# EAGLE design theremin-shield (EAGLE 6.0)
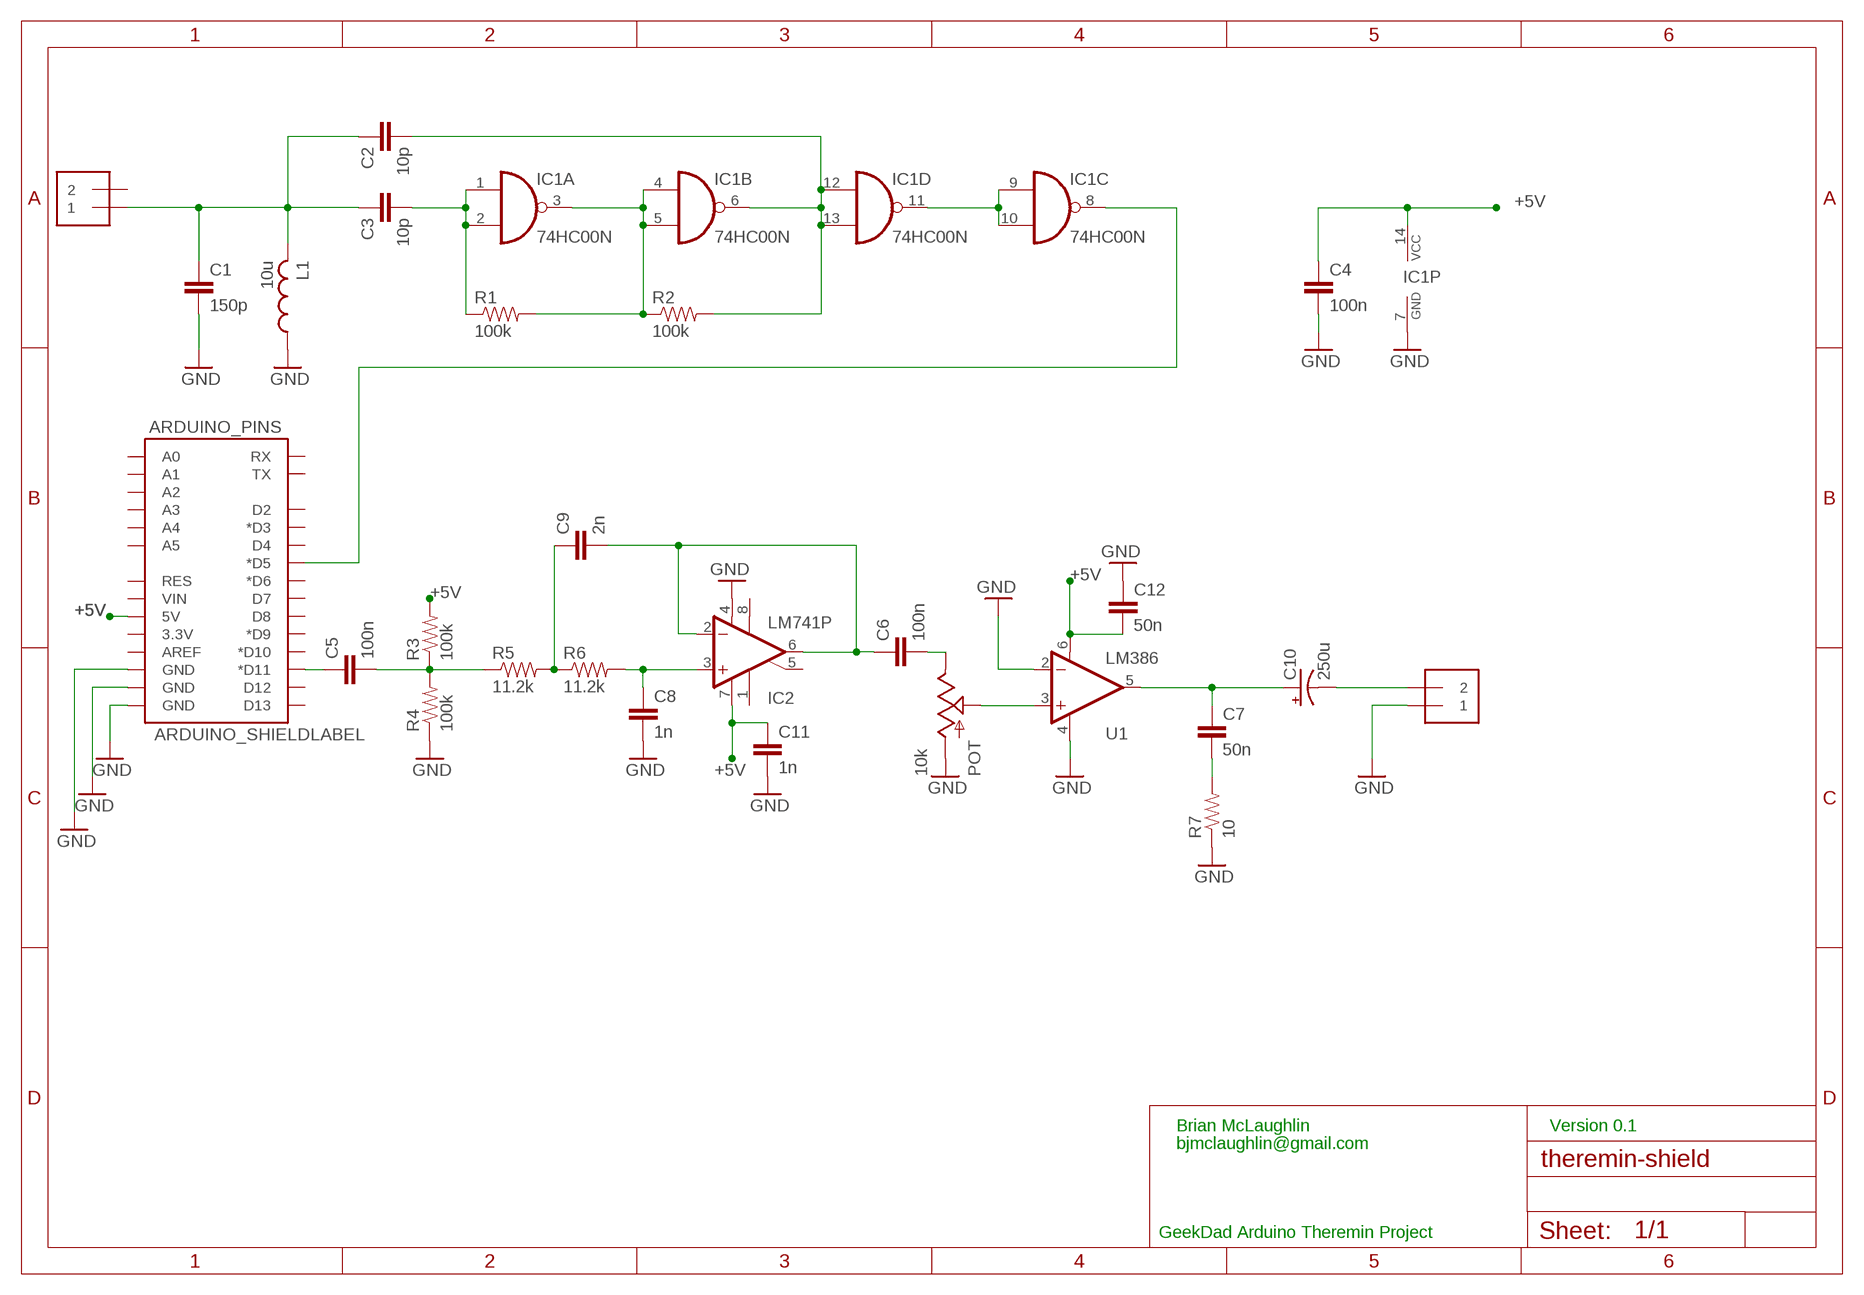
[diagram p0: schematic, sheet 1]

## Parts
ARDUINO_PINS  ARDUINO_SHIELDLABEL  [DUEMILANOVE_SHIELD]
C1  150p  CAPPTH  [CAP-PTH-SMALL]
C2  10p  CAPPTH  [CAP-PTH-SMALL]
C3  10p  CAPPTH  [CAP-PTH-SMALL]
C4  100n  CAPPTH  [CAP-PTH-SMALL]
C5  100n  CAPPTH3  [CAP-PTH-LARGE]
C6  100n  CAPPTH3  [CAP-PTH-LARGE]
C7  50n  CAPPTH2  [CAP-PTH-SMALL2]
C8  1n  CAPPTH2  [CAP-PTH-SMALL2]
C9  2n  CAPPTH2  [CAP-PTH-SMALL2]
C10  250u  CAP_POLPTH4  [CPOL-RADIAL-1000UF-25V]
C11  1n  CAPPTH2  [CAP-PTH-SMALL2]
C12  50n  CAPPTH2  [CAP-PTH-SMALL2]
IC1  74HC00N  [DIL14]
IC2  LM741P  [DIL08]
J1  1X2-3.5MM  [1X2-3.5MM]
J2  1X2-3.5MM  [1X2-3.5MM]
L1  10u  L-US0204/7  [0204/7]
POT  10k  POT  [ALPS_POT]
R1  100k  RESISTORPTH-1/4W  [AXIAL-0.4]
R2  100k  RESISTORPTH-1/4W  [AXIAL-0.4]
R3  100k  RESISTORPTH-1/4W  [AXIAL-0.4]
R4  100k  RESISTORPTH-1/4W  [AXIAL-0.4]
R5  11.2k  RESISTORPTH-1/4W  [AXIAL-0.4]
R6  11.2k  RESISTORPTH-1/4W  [AXIAL-0.4]
R7  10  RESISTORPTH-1/4W  [AXIAL-0.4]
U1  LM386  [DIP08]

## Nets
+5V: ARDUINO_PINS.5V C4.1 C11.1 C12.2 IC1.14(P:VCC) IC2.7(V+) R3.P$2 U1.6(V+)
GND: ARDUINO_PINS.GND@0(GND) ARDUINO_PINS.GND@1(GND) ARDUINO_PINS.GND@2(GND) C1.2 C4.2 C8.2 C11.2 C12.1 IC1.7(P:GND) IC2.4(V-) J1.1 L1.1 POT.P$3(A) R4.P$1 R7.P$1 U1.2(-IN) U1.4(V-)
N$1: C3.2 IC1.1(A:I0) IC1.2(A:I1) R1.P$1
N$2: IC1.3(A:O) IC1.4(B:I0) IC1.5(B:I1) R1.P$2 R2.P$1
N$3: ARDUINO_PINS.D11(*D11) C5.1
N$4: C2.2 IC1.6(B:O) IC1.12(D:I0) IC1.13(D:I1) R2.P$2
N$5: C1.1 C2.1 C3.1 J2.1 L1.2
N$6: IC1.9(C:I0) IC1.10(C:I1) IC1.11(D:O)
N$7: ARDUINO_PINS.D5(*D5) IC1.8(C:O)
N$8: C6.1 C9.2 IC2.2(-IN) IC2.6(OUT)
N$10: C5.2 R3.P$1 R4.P$2 R5.P$1
N$11: C8.1 IC2.3(+IN) R6.P$2
N$12: C6.2 POT.P$1(E)
N$13: C9.1 R5.P$2 R6.P$1
N$14: POT.P$2(S) U1.3(+IN)
N$15: C7.1 C10.1(+) U1.5(OUT)
N$16: C7.2 R7.P$2
N$17: C10.2(-) J1.2
Unconnected: ARDUINO_PINS.3.3V ARDUINO_PINS.A0 ARDUINO_PINS.A1 ARDUINO_PINS.A2 ARDUINO_PINS.A3 ARDUINO_PINS.A4 ARDUINO_PINS.A5 ARDUINO_PINS.AREF ARDUINO_PINS.D2 ARDUINO_PINS.D3(*D3) ARDUINO_PINS.D4 ARDUINO_PINS.D6(*D6) ARDUINO_PINS.D7 ARDUINO_PINS.D8 ARDUINO_PINS.D9(*D9) ARDUINO_PINS.D10(*D10) ARDUINO_PINS.D12 ARDUINO_PINS.D13 ARDUINO_PINS.RES ARDUINO_PINS.RX ARDUINO_PINS.TX ARDUINO_PINS.VIN IC2.1(ON1) IC2.5(ON2) IC2.8(OPT) J2.2

## Notes on the sheet
- Brian McLaughlin | Version 0.1
- bjmclaughlin@gmail.com
- GeekDad Arduino Theremin Project

## Library data of the parts
ARDUINO_PINS = SparkFun:ARDUINO_SHIELD
C1-C9 C11 C12 = SparkFun:CAP: Capacitor Standard 0603 ceramic capacitor, and 0.1" leaded capacitor.
C10 = SparkFun:CAP_POL: Capacitor Polarized These are standard SMD and PTH capacitors. Normally 10uF, 47uF, and 100uF in electrolytic and tantalum varieties. Always verify the external diameter of the through hole cap, it varies with capacity, voltage, and manufacturer. The EIA devices should be standard.
IC1 = 74xx-eu:74*00: Quad 2-input NAND gate
IC2 = linear:*741: OP AMP
J1 J2 = adafruit:1X2: 3.5mm Terminal block http://www.ladyada.net/library/pcb/eaglelibrary.html
L1 = rcl:L-US: INDUCTOR, American symbol
POT = SparkFun:POT
R1-R7 = SparkFun:RESISTOR: Resistor Basic schematic elements and footprints for 0603, 1206, and PTH resistors.
U1 = SparkFun:LM386: low voltage audio power amplifier

## Board
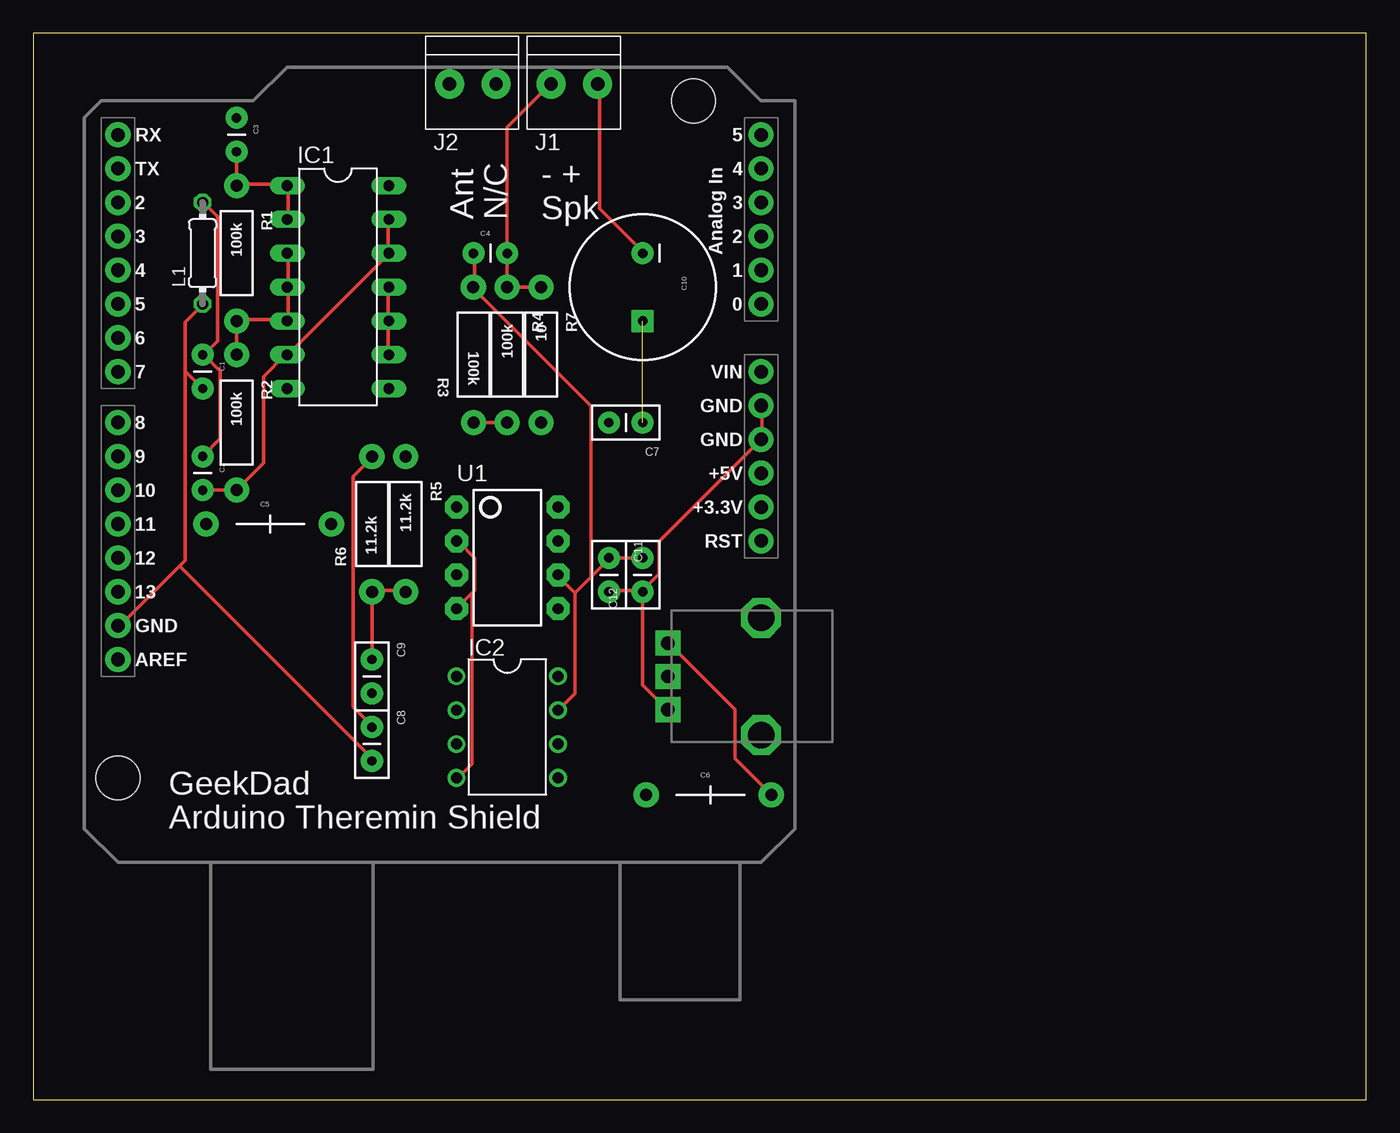
[diagram p1: board, top side]
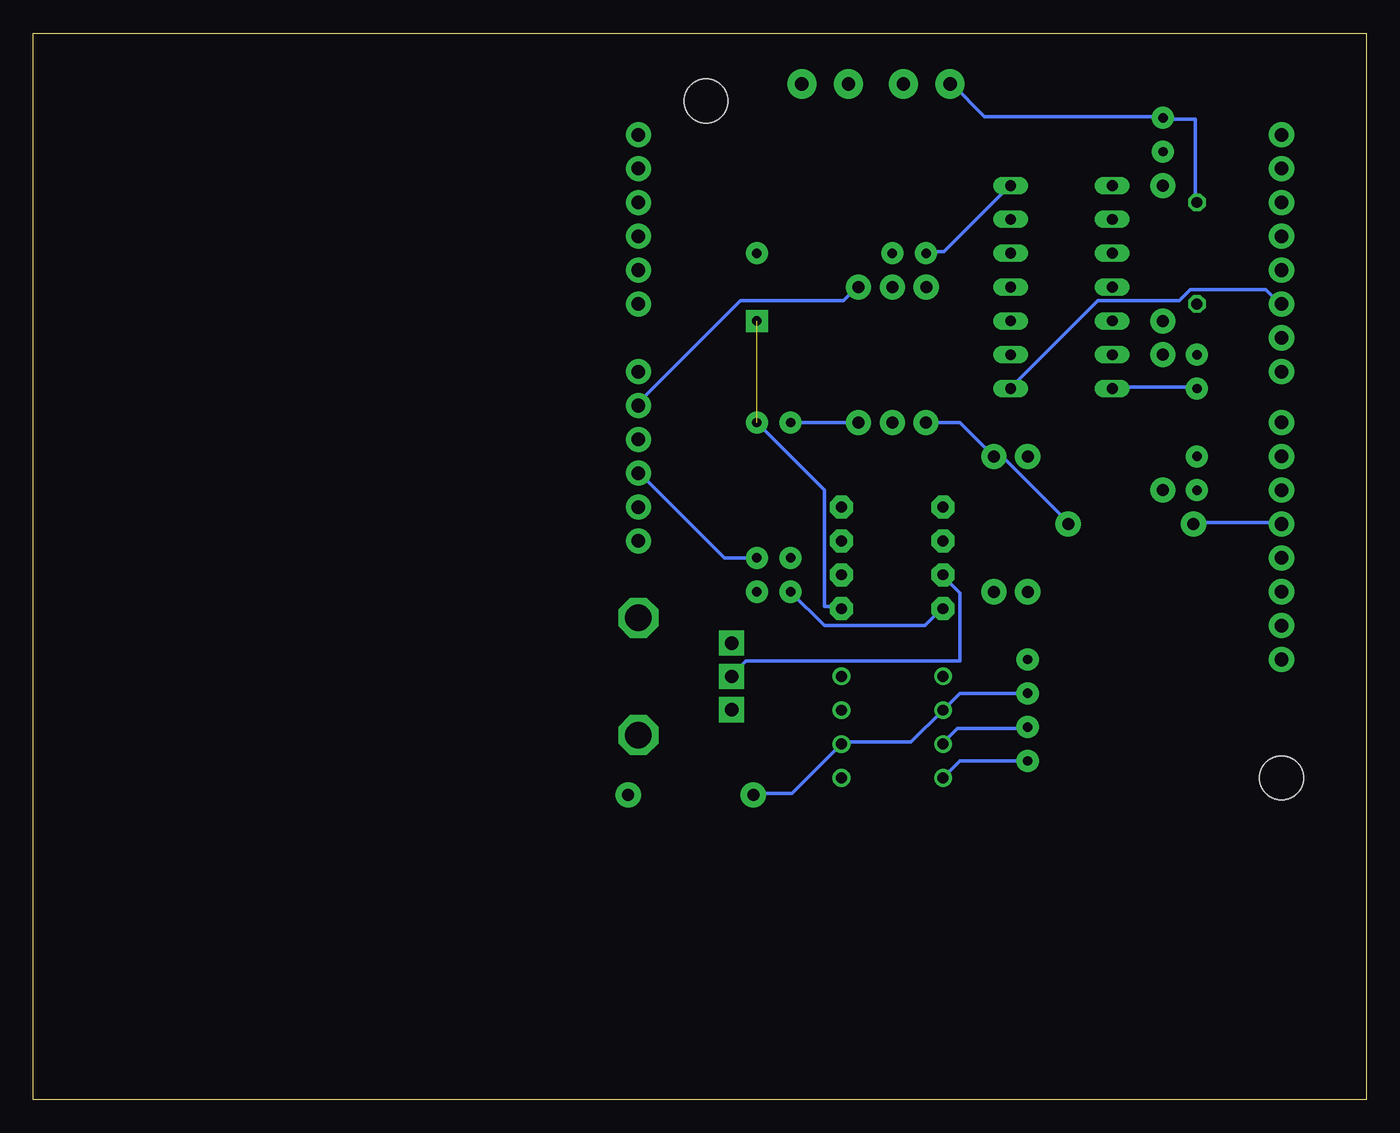
[diagram p2: board, bottom side, seen from below]

Size 100 x 80 mm. Coordinates in mm from the lower left corner, seen from the top.
Outline: 0,0 100,0 100,80 0,80 0,0
Copper layers (1*16): Top 0.035mm / dielectric 1.5mm / Bottom 0.035mm
Design rules: minimum track width 10mil, minimum drill 20mil, track to track 8mil, track to pad 8mil, pad to pad 8mil, via to via 8mil, smd to smd 8mil, copper to edge 40mil, drill to drill 8mil, minimum pad ring 10mil, minimum via ring 8mil, stop-mask expansion 4mil, vias tented up to drill 0mil, thermal gap 10mil

### Footprints (pad centres in the part's own frame; a part is rotated, then mirrored left to right if it is on the bottom)
DUEMILANOVE_SHIELD = drill 1.016 pad 1.88: 3.3V 50.8,26.67; 5V 50.8,29.21; A0 50.8,41.91; A1 50.8,44.45; A2 50.8,46.99; A3 50.8,49.53; A4 50.8,52.07; A5 50.8,54.61; AREF 2.54,15.24; D2 2.54,49.53; D3 2.54,46.99; D4 2.54,44.45; D5 2.54,41.91; D6 2.54,39.37; D7 2.54,36.83; D8 2.54,33.02; D9 2.54,30.48; D10 2.54,27.94; D11 2.54,25.4; D12 2.54,22.86; D13 2.54,20.32; GND@0 50.8,31.75; GND@1 50.8,34.29; GND@2 2.54,17.78; RES 50.8,24.13; RX 2.54,54.61; TX 2.54,52.07; VIN 50.8,36.83 | hole 3.302: 45.72,57.15; 2.54,6.35
CAP-PTH-SMALL = drill 0.7 pad 1.651: 1 0,0; 2 2.54,0
CAP-PTH-LARGE = drill 0.9 pad 1.905: 1 -4.826,0; 2 4.572,0
CAP-PTH-SMALL2 = drill 0.7 pad 1.651: 1 0,0; 2 2.54,0
CPOL-RADIAL-1000UF-25V = drill 0.7 pad 1.651 square: 1 2.54,0 | drill 0.7 pad 1.651: 2 -2.54,0
DIL14 = drill 0.813 long: 1 -7.62,-3.81; 2 -5.08,-3.81; 3 -2.54,-3.81; 4 0,-3.81; 5 2.54,-3.81; 6 5.08,-3.81; 7 7.62,-3.81; 8 7.62,3.81; 9 5.08,3.81; 10 2.54,3.81; 11 0,3.81; 12 -2.54,3.81; 13 -5.08,3.81; 14 -7.62,3.81
DIL08 = drill 0.813 pad 1.27: 1 -3.81,-3.81; 2 -1.27,-3.81; 3 1.27,-3.81; 4 3.81,-3.81; 5 3.81,3.81; 6 1.27,3.81; 7 -1.27,3.81; 8 -3.81,3.81
1X2-3.5MM = drill 1 pad 2.184: 1 1.8,0; 2 -1.7,0
0204/7 = drill 0.813 octagon: 1 -3.81,0; 2 3.81,0
ALPS_POT = drill 1 pad 1.88 square: P$1 7,-2.5; P$2 7,0; P$3 7,2.5 | drill 2 octagon: P$4 0,-4.4; P$5 0,4.4
AXIAL-0.4 = drill 0.9 pad 1.88: P$1 -5.08,0; P$2 5.08,0
DIP08 = drill 0.813 pad 1.727 octagon: 1 -3.81,-3.81; 2 -1.27,-3.81; 3 1.27,-3.81; 4 3.81,-3.81; 5 3.81,3.81; 6 1.27,3.81; 7 -1.27,3.81; 8 -3.81,3.81

### Placement (x,y rotation side)
ARDUINO_PINS  3.81,17.78 0 top
C1  12.7,55.88 270 top
C2  12.7,48.26 270 top
C3  15.24,73.66 270 top
C4  33.02,63.5 0 top
C5  17.78,43.18 0 top
C6  50.8,22.86 0 top
C7  45.72,50.8 180 top
C8  25.4,27.94 270 top
C9  25.4,33.02 270 top
C10  45.72,60.96 270 top
C11  43.18,40.64 270 top
C12  45.72,38.1 90 top
IC1  22.86,60.96 270 top
IC2  35.56,27.94 270 top
J1  40.64,76.2 180 top
J2  33.02,76.2 180 top
L1  12.7,63.5 90 top
POT  54.61,31.75 180 top
R1  15.24,63.5 270 top
R2  15.24,50.8 270 top
R3  33.02,55.88 90.1 top
R4  35.56,55.88 270 top
R5  27.94,43.18 270 top
R6  25.4,43.18 90 top
R7  38.1,55.88 270 top
U1  35.56,40.64 270 top

### Tracks (layer width: path | path; a pad name or v marks a point on that pad's centre or on a via)
+5V
  Top 0.254: C4.1 33.12,63.4 33.12,60.96 R3.P$2 33.12,60.76 41.86,52.02 41.86,39.22 | IC2.7 40.64,30.48 40.64,38 | 40.64,38 39.42,39.22 U1.6 | C12.2 C11.1 43.08,40.64 43.08,40.44 41.86,39.22 | 41.86,39.22 40.64,38
  Bottom 0.254: IC1.14 26.82,68.48 31.7,63.6 32.92,63.6 C4.1 | C12.2 48.16,40.64 54.46,46.94 ARDUINO_PINS.5V
GND
  Top 0.254: 11.38,54.66 11.38,58.32 12.6,59.54 L1.1 | C1.2 11.38,54.66 | 10.97,40.03 11.38,40.44 11.38,54.66 | 10.97,40.03 6.5,35.56 ARDUINO_PINS.GND@2 | R7.P$1 R4.P$1 C4.2 35.56,72.95 38.81,76.2 J1.1 | 32.92,38 33.12,38.2 33.12,40.64 31.9,41.86 U1.2 | 32.92,38 U1.4 | ARDUINO_PINS.GND@1 54.66,52.02 54.66,49.58 ARDUINO_PINS.GND@0 46.94,41.86 46.94,39.42 45.72,38.2 | 45.72,38.2 43.28,38.2 C11.2 | POT.P$3 47.55,29.26 45.72,31.09 C12.1 45.72,38.2 | 32.92,38 32.92,25.2 31.9,24.18 IC2.4 | 10.97,40.03 25.4,25.6 C8.2
  Bottom 0.254: IC1.7 18.9,53.44 12.8,53.44 C1.2 | IC2.4 30.48,25.4 C8.2 | C11.2 40.64,35.56 33.12,35.56 31.9,36.78 U1.4 | R7.P$1 38.2,60.96 39.22,59.94 46.94,59.94 54.66,52.22 ARDUINO_PINS.GND@1
N$1
  Top 0.254: IC1.2 19.1,66.04 19.1,68.48 IC1.1 18.9,68.68 15.24,68.68 | 15.24,68.68 C3.2 | 15.24,68.68 R1.P$1
N$2
  Top 0.254: 19.1,60.96 19.1,58.52 IC1.5 18.9,58.52 15.24,58.52 R1.P$2 R2.P$1 | 19.1,60.96 19.1,63.4 IC1.3 | 19.1,60.96 IC1.4
N$3
  Bottom 0.254: ARDUINO_PINS.D11 6.5,43.28 12.8,43.28 C5.1
N$4
  Top 0.254: C2.2 R2.P$2 17.27,47.75 17.27,54.25 18.9,55.88 IC1.6 19.1,55.88 26.62,63.4 IC1.12 26.62,63.6 26.62,66.04 IC1.13
N$5
  Top 0.254: C2.1 14.02,49.58 14.02,54.66 12.8,55.88 | 12.8,55.88 13.82,56.9 13.82,66.24 12.8,67.26 L1.2 | 12.8,55.88 C1.1
  Bottom 0.254: L1.2 12.8,67.46 12.8,73.56 15.24,73.56 C3.1 15.24,73.76 28.65,73.76 31.09,76.2 J2.1
N$6
  Top 0.254: IC1.9 26.62,55.88 26.62,58.32 IC1.10 26.62,58.52 26.62,60.96 IC1.11
N$7
  Bottom 0.254: IC1.8 26.62,53.44 20.12,59.94 14.02,59.94 13.21,60.76 7.52,60.76 6.5,59.74 ARDUINO_PINS.D5
N$8
  Bottom 0.254: C9.2 30.48,30.48 IC2.2 34.14,26.82 39.22,26.82 IC2.6 43.08,22.96 45.92,22.96 C6.1
N$10
  Top 0.254: R4.P$2 33.12,50.8 R3.P$1
  Bottom 0.254: R3.P$1 32.92,50.8 30.48,50.8 R5.P$1 27.84,48.16 27.23,48.16 22.35,43.28 C5.2
N$11
  Top 0.254: R6.P$2 25.4,48.16 23.98,46.74 23.98,29.46 25.4,28.04 C8.1
  Bottom 0.254: IC2.3 31.7,26.82 30.68,27.84 25.4,27.84 C8.1
N$12
  Top 0.254: C6.2 52.63,25.6 52.63,29.26 47.75,34.14 POT.P$1
N$13
  Top 0.254: C9.1 R6.P$1 25.4,38.2 27.84,38.2 R5.P$2
N$14
  Bottom 0.254: U1.3 31.7,39.22 30.48,38 30.48,32.92 46.53,32.92 47.55,31.9 POT.P$2
N$15  (1 unrouted)
  Bottom 0.254: C7.1 40.64,45.72 40.64,36.98 39.42,36.98 U1.5
N$16
  Bottom 0.254: R7.P$2 C7.2
N$17
  Top 0.254: C10.2 45.72,63.6 42.47,66.85 42.47,76.2 J1.2

### Text on the board
tPlace: - + | Ant | N/C | Spk | GeekDad | Arduino Theremin Shield